# Altium schematic sheet MCU.SchDoc: MCU
size 431 x 279 mm; Author: Alberto Marrone, Christian Schmitz, Leo Walter; DrawnBy: Alberto Marrone, Christian Schmitz, Leo Walter; Engineer: Alberto Marrone, Christian Schmitz, Leo Walter; Revision: V1.0; SheetNumber: 5; Project: PCB Design Final Project
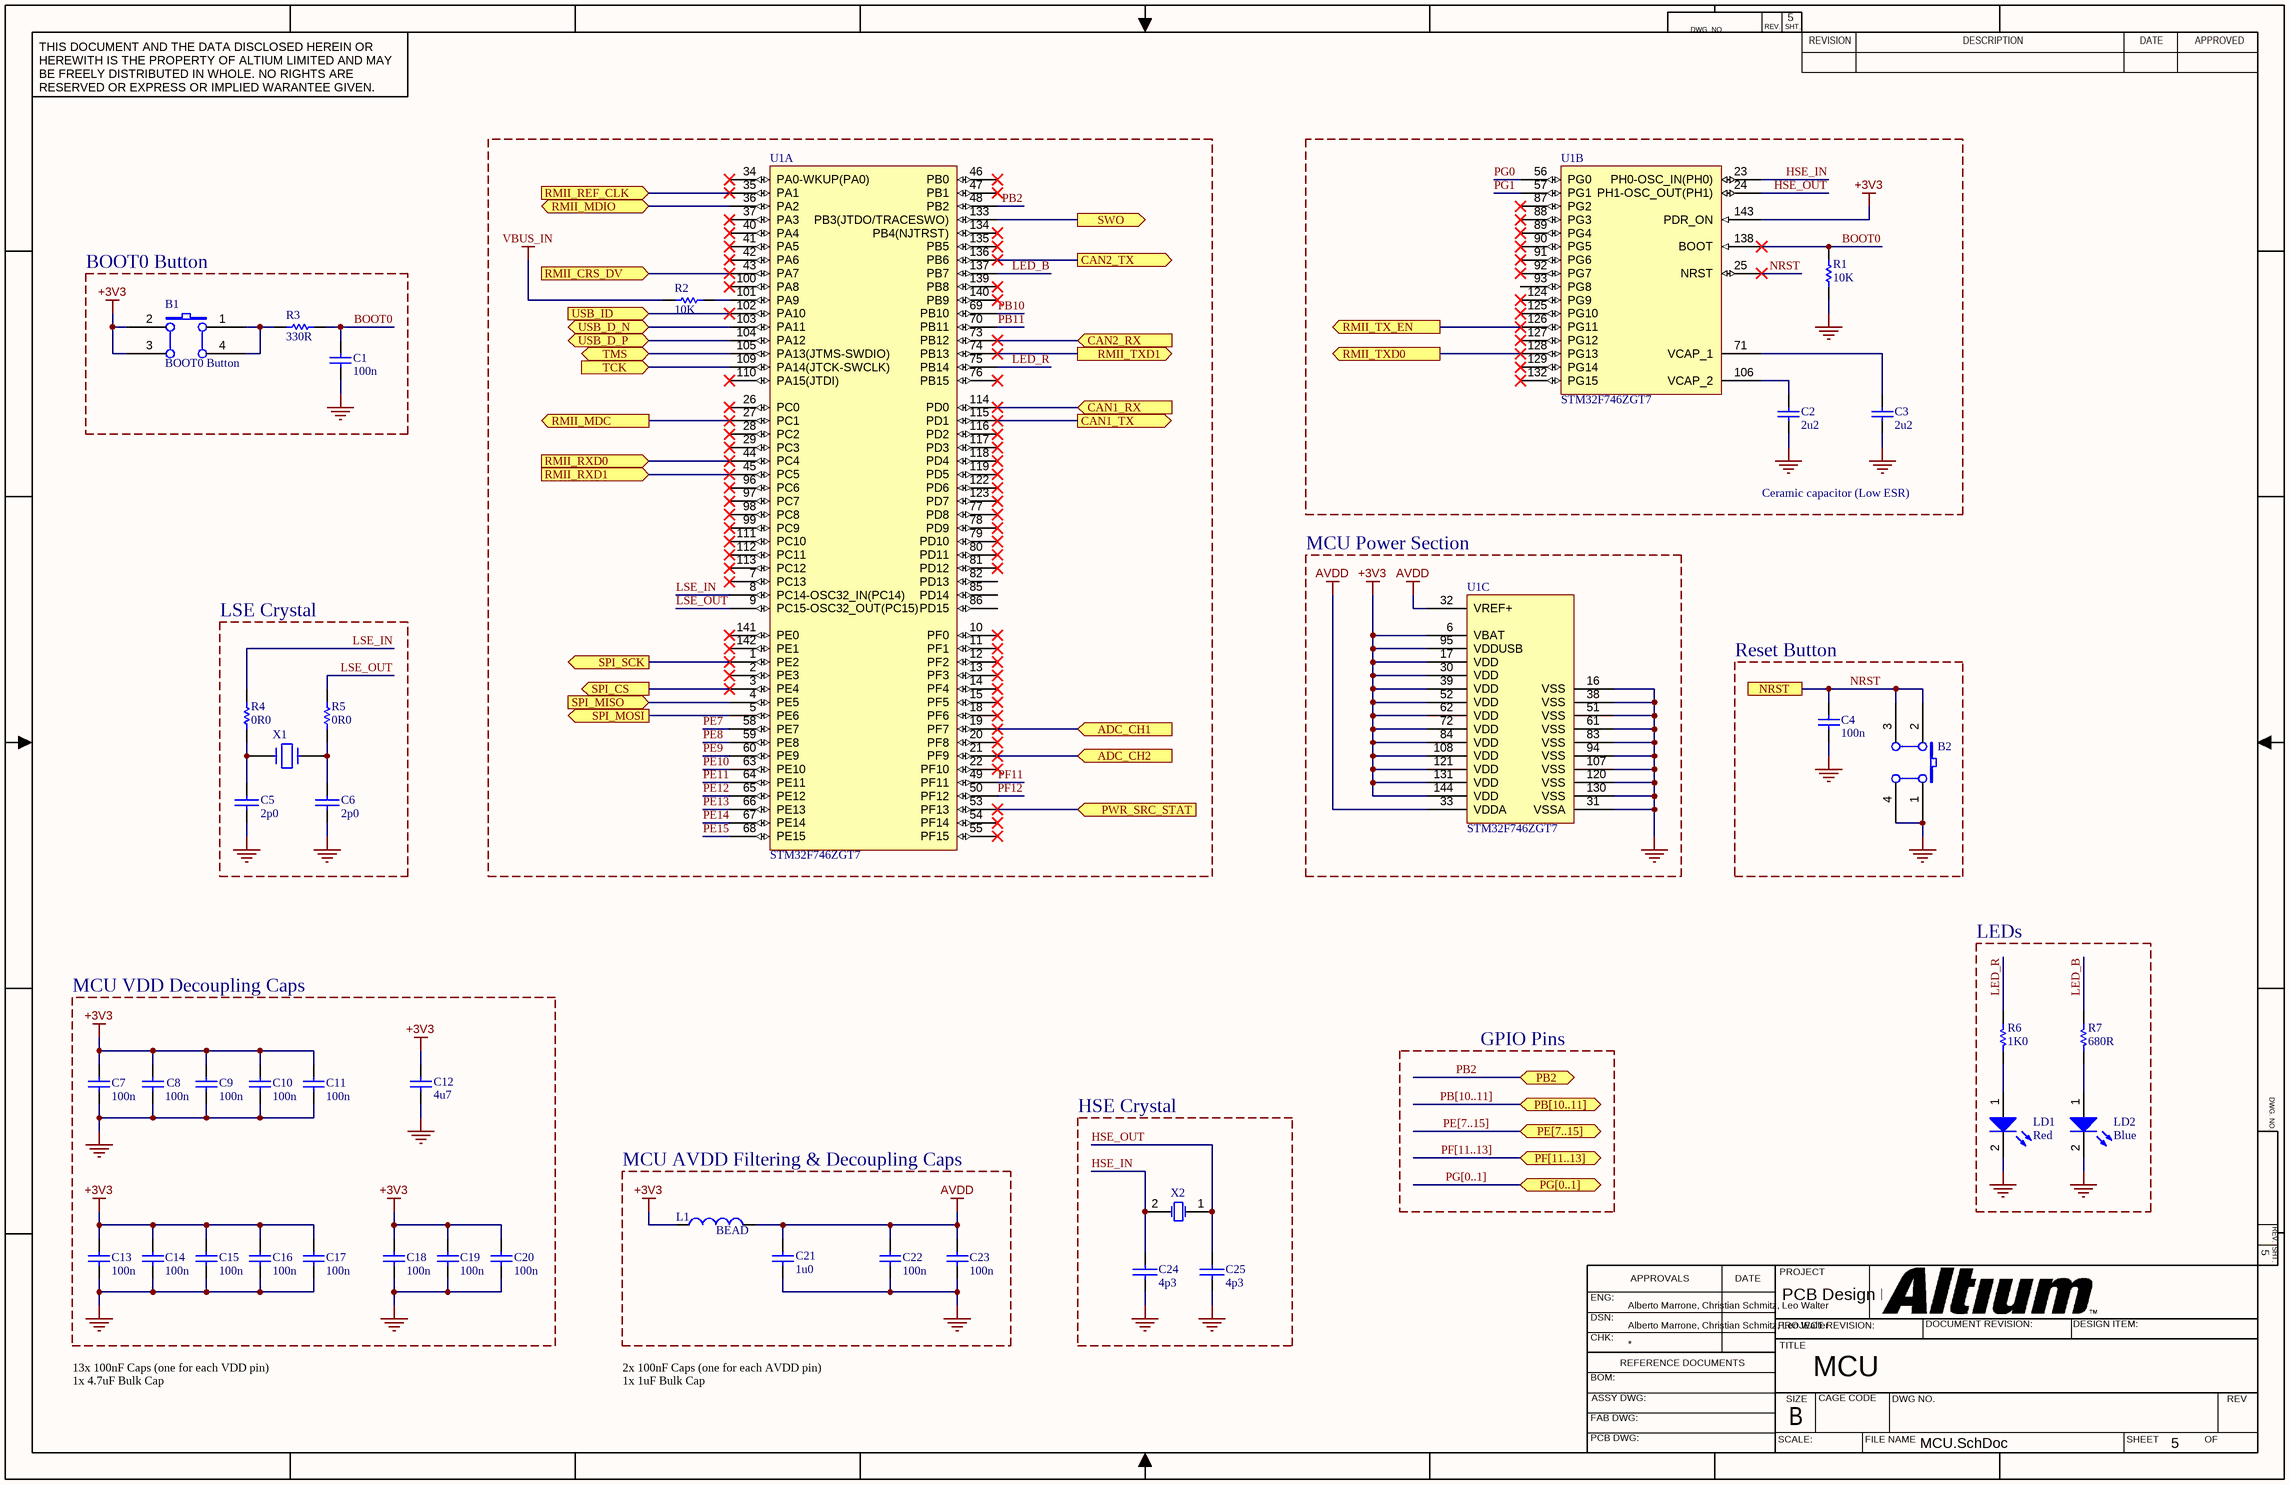
[diagram p0: MCU.SchDoc]

## Parts
B1  BOOT0 Button  [PB-6X6mm-Blue]
B2  TS40-66-33-BK-160-SMT-TR  [PB-6X6mm-Black]  (value not drawn)
C1  100n  [0603C]
C2  2u2  [TAN-A]
C3  2u2  [TAN-A]
C4  100n  [0603C]
C5  2p0  [0603C]
C6  2p0  [0603C]
C7  100n  [0603C]
C8  100n  [0603C]
C9  100n  [0603C]
C10  100n  [0603C]
C11  100n  [0603C]
C12  4u7  [0603C]
C13  100n  [0603C]
C14  100n  [0603C]
C15  100n  [0603C]
C16  100n  [0603C]
C17  100n  [0603C]
C18  100n  [0603C]
C19  100n  [0603C]
C20  100n  [0603C]
C21  1u0  [0603C]
C22  100n  [0603C]
C23  100n  [0603C]
C24  4p3  [0603C]
C25  4p3  [0603C]
L1  BEAD  [0603L]
LD1  Red  [0603D-R]
LD2  Blue  [0603D-B]
R1  10K  [0603R]
R2  10K  [0603R]
R3  330R  [0603R]
R4  0R0  [0603R]
R5  0R0  [0603R]
R6  1K0  [0603R]
R7  680R  [0603R]
U1  STM32F746ZGT7  [STM-LQFP144_M]  (parts A,B,C of 3)
X1  ABS07-120-32.768KHZ-T  [XTAL_2SM_3R2X1R5]  (value not drawn)
X2  ABM8AAIG-8.000MHz-V2R-T3  [OSC_2SM_3R2x2R5]  (value not drawn)

## Blocks framed on the sheet
Ceramic capacitor (Low ESR): C2 C3 R1 U1
BOOT0 Button: B1 C1 R3
MCU Power Section: U1
LSE Crystal: C5 C6 R4 R5 X1
Reset Button: B2 C4
LEDs: LD1 LD2 R6 R7
MCU VDD Decoupling Caps: C7-C20
HSE Crystal: C24 C25 X2
MCU AVDD Filtering & Decoupling Caps: C21-C23 L1

## Ports
ADC_CH1 (in), ADC_CH2 (in), CAN1_RX (in), CAN1_TX (out), CAN2_RX (in), CAN2_TX (out), NRST, PB2 (bidir), PB[10..11] (bidir), PE[7..15] (bidir), PF[11..13] (bidir), PG[0..1] (bidir), PWR_SRC_STAT (in), RMII_CRS_DV (in), RMII_MDC (out), RMII_MDIO (bidir), RMII_REF_CLK (in), RMII_RXD0 (in), RMII_RXD1 (in), RMII_TX_EN (out), RMII_TXD0 (out), RMII_TXD1 (out), SPI_CS (out), SPI_MISO (in), SPI_MOSI (out), SPI_SCK (out), SWO (out), TCK (in), TMS (bidir), USB_D_N (bidir), USB_D_P (bidir), USB_ID (in)

## Nets
+3V3: B1.2(B0) B1.3(B1) C7.1 C8.1 C9.1 C10.1 C11.1 C12.1 C13.1 C14.1 C15.1 C16.1 C17.1 C18.1 C19.1 C20.1 L1.1 U1.6(VBAT) U1.17(VDD) U1.30(VDD) U1.39(VDD) U1.52(VDD) U1.62(VDD) U1.72(VDD) U1.84(VDD) U1.95(VDDUSB) U1.108(VDD) U1.121(VDD) U1.131(VDD) U1.143(PDR_ON) U1.144(VDD)
AVDD: C21.1 C22.1 C23.1 L1.2 U1.32(VREF+) U1.33(VDDA)
GND: B2.1(A0) B2.4(A1) C1.1 C2.2 C3.2 C4.1 C5.2 C6.2 C7.2 C8.2 C9.2 C10.2 C11.2 C12.2 C13.2 C14.2 C15.2 C16.2 C17.2 C18.2 C19.2 C20.2 C21.2 C22.2 C23.2 C24.2 C25.2 LD1.2(K) LD2.2(K) R1.2 U1.16(VSS) U1.31(VSSA) U1.38(VSS) U1.51(VSS) U1.61(VSS) U1.83(VSS) U1.94(VSS) U1.107(VSS) U1.120(VSS) U1.130(VSS)
VBUS_IN: R2.1
ADC_CH1: U1.19(PF7) ; port ADC_CH1
ADC_CH2: U1.21(PF9) ; port ADC_CH2
BOOT0: C1.2 R1.1 R3.2 U1.138(BOOT)
CAN1_RX: U1.114(PD0) ; port CAN1_RX
CAN1_TX: U1.115(PD1) ; port CAN1_TX
CAN2_RX: U1.73(PB12) ; port CAN2_RX
CAN2_TX: U1.136(PB6) ; port CAN2_TX
HSE_IN: C24.1 U1.23(PH0-OSC_IN(PH0)) X2.2(OSC2)
HSE_OUT: C25.1 U1.24(PH1-OSC_OUT(PH1)) X2.1(OSC1)
LED_B: R7.1 U1.137(PB7)
LED_R: R6.1 U1.75(PB14)
LSE_IN: R4.2 U1.8(PC14-OSC32_IN(PC14))
LSE_OUT: R5.2 U1.9(PC15-OSC32_OUT(PC15))
NRST: B2.2(B0) B2.3(B1) C4.2 U1.25(NRST) ; port NRST
PB2: U1.48(PB2) ; port PB2
PB10: U1.69(PB10)
PB11: U1.70(PB11)
PE7: U1.58(PE7)
PE8: U1.59(PE8)
PE9: U1.60(PE9)
PE10: U1.63(PE10)
PE11: U1.64(PE11)
PE12: U1.65(PE12)
PE13: U1.66(PE13)
PE14: U1.67(PE14)
PE15: U1.68(PE15)
PF11: U1.49(PF11)
PF12: U1.50(PF12)
PG0: U1.56(PG0)
PG1: U1.57(PG1)
PWR_SRC_STAT: U1.53(PF13) ; port PWR_SRC_STAT
RMII_CRS_DV: U1.43(PA7) ; port RMII_CRS_DV
RMII_MDC: U1.27(PC1) ; port RMII_MDC
RMII_MDIO: U1.36(PA2) ; port RMII_MDIO
RMII_REF_CLK: U1.35(PA1) ; port RMII_REF_CLK
RMII_RXD0: U1.44(PC4) ; port RMII_RXD0
RMII_RXD1: U1.45(PC5) ; port RMII_RXD1
RMII_TX_EN: U1.126(PG11) ; port RMII_TX_EN
RMII_TXD0: U1.128(PG13) ; port RMII_TXD0
RMII_TXD1: U1.74(PB13) ; port RMII_TXD1
SPI_CS: U1.3(PE4) ; port SPI_CS
SPI_MISO: U1.4(PE5) ; port SPI_MISO
SPI_MOSI: U1.5(PE6) ; port SPI_MOSI
SPI_SCK: U1.1(PE2) ; port SPI_SCK
SWO: U1.133(PB3(JTDO/TRACESWO)) ; port SWO
TCK: U1.109(PA14(JTCK-SWCLK)) ; port TCK
TMS: U1.105(PA13(JTMS-SWDIO)) ; port TMS
USB_D_N: U1.103(PA11) ; port USB_D_N
USB_D_P: U1.104(PA12) ; port USB_D_P
USB_ID: U1.102(PA10) ; port USB_ID
NetB1_1: B1.1(A0) B1.4(A1) R3.1
NetC2_1: C2.1 U1.106(VCAP_2)
NetC3_1: C3.1 U1.71(VCAP_1)
NetC5_1: C5.1 R4.1 X1.2
NetC6_1: C6.1 R5.1 X1.1
NetLD1_1: LD1.1(A) R6.2
NetLD2_1: LD2.1(A) R7.2
NetR2_2: R2.2 U1.101(PA9)

Not connected (* = marked no-connect by the designer): U1 2(PE3)* 7(PC13)* 10(PF0)* 11(PF1)* 12(PF2)* 13(PF3)* 14(PF4)* 15(PF5)* 18(PF6)* 20(PF8)* 22(PF10)* 26(PC0)* 28(PC2)* 29(PC3)* 34(PA0-WKUP(PA0))* 37(PA3)* 40(PA4)* 41(PA5)* 42(PA6)* 46(PB0)* 47(PB1)* 54(PF14)* 55(PF15)* 76(PB15)* 77(PD8)* 78(PD9)* 79(PD10)* 80(PD11)* 81(PD12)* 82(PD13) 85(PD14) 86(PD15) 87(PG2)* 88(PG3)* 89(PG4)* 90(PG5)* 91(PG6)* 92(PG7)* 93(PG8) 96(PC6)* 97(PC7)* 98(PC8)* 99(PC9)* 100(PA8)* 110(PA15(JTDI))* 111(PC10)* 112(PC11)* 113(PC12)* 116(PD2)* 117(PD3)* 118(PD4)* 119(PD5)* 122(PD6)* 123(PD7)* 124(PG9)* 125(PG10)* 127(PG12)* 129(PG14)* 132(PG15)* 134(PB4(NJTRST))* 135(PB5)* 139(PB8)* 140(PB9)* 141(PE0)* 142(PE1)*

## Buses and harness runs
bus PB[10..11] = port PB[10..11]
bus PE[7..15] = port PE[7..15]
bus PF[11..13] = port PF[11..13]
bus PG[0..1] = port PG[0..1]

## Notes on the sheet
- GPIO Pins
- 13x 100nF Caps (one for each VDD pin)
  1x 4.7uF Bulk Cap
- 2x 100nF Caps (one for each AVDD pin)
  1x 1uF Bulk Cap
- DWG. NO.
- REV.
- SHT.
- THIS DOCUMENT AND THE DATA DISCLOSED HEREIN OR HEREWITH IS THE PROPERTY OF ALTIUM LIMITED AND MAY BE FREELY DISTRIBUTED IN WHOLE. NO RIGHTS ARE RESERVED OR EXPRESS OR IMPLIED WARANTEE GIVEN.
- REVISION
- DESCRIPTION
- DATE
- APPROVED
- ENG:
- APPROVALS
- PROJECT
- DSN:
- CHK:
- REFERENCE DOCUMENTS
- PROJECT REVISION:
- TITLE
- DOCUMENT REVISION:
- DESIGN ITEM:
- BOM:
- FAB DWG:
- PCB DWG:
- ASSY DWG:
- SCALE:
- SIZE
- B
- CAGE CODE
- FILE NAME
- DWG NO.
- SHEET
- OF
- REV

## Library data of the parts
B1 B2 = SW PUSHBUTTON: SE PUSHBUTTON
C1 C4 C7-C11 C13-C20 C22 C23 = Cap: Capacitor; Dielectric: X7R; Published: 8-Jun-2000; Revision: July-2002: Re-released for DXP Platform.; Publisher: Altium Limited; Value: 100n
C2 C3 = Cap_2.2uF_X7R_10%_0805: Capacitor,2.2uF,16V, X7R,10%,0805,YAGEO; Manuf_Part_1: CC0805KKX7R7BB225; Revision: July-2002: Re-released for DXP Platform.; Value: 2u2; Order: CC0805KKX7R7BB225; Manuf_1: YAGEO; Dielectric: X7R
C5 C6 C24 C25 = CAP: Capacitor; Dielectric: C0G
  C5 C6: Value: 2p0
  C24 C25: Value: 4p3
C12 = CAP SMD 0603  X5R 1µF 25V 10%: Capacitor; Rated voltage: 25V; Tolerance: 10%; Dielectric: X5R; Manufacturer: *; Manufacturer P/N: *; Order code Farnell: 1288202RL; Value: 4u7; Power: *; Temperature  Factor: *; Temperature Max: +125°C; Temperature Min: -55°C; STS Code: *
C21 = CAP SMD 0603  X5R 1µF 25V 10%: Capacitor; Voltage Rating: 25V; Tolerance: 10%; Dielectric: X5R; Manufacturer: *; Manufacturer P/N: *; Order code Farnell: 1288202RL; Value: 1u0; Power: *; Temperature  Factor: *; Temperature Max: +125°C; Temperature Min: -55°C; STS Code: *
L1 = Inductor: Value: 100uH; Published: 8-Jun-2000; Revision: July-2002: Re-released for DXP Platform.; Publisher: Altium Limited
LD1 LD2 = LED2: Typical RED, GREEN, YELLOW, AMBER GaAs LED; Published: 8-Jun-2000; Revision: July-2002: Re-released for DXP Platform.; Publisher: Altium Limited
R1 R2 = res1: Resistor; Published: 8-Jun-2000; Revision: July-2002: Re-released for DXP Platform.; Publisher: Altium Limited; Value: 10K
R3 R6 R7 = Res1: Resistor; Published: 8-Jun-2000; Revision: July-2002: Re-released for DXP Platform.; Publisher: Altium Limited
  R3: Value: 330R
  R6: Value: 1K0
  R7: Value: 680R
R4 R5 = Res1: Resistor; Value: 1K; Published: 8-Jun-2000; Revision: July-2002: Re-released for DXP Platform.; Publisher: Altium Limited
U1 = CMP-1572-00045-1: ARM Cortex-M4 32-bit MCU+FPU, 1024 KB Flash, 320 KB Internal RAM, 114 I/Os, 144-Pin LQFP, -40 to 105 degC, Tray; I/Os (High Current): 114; FLASH Size (Prog) (kB): 1024; Core: ARM Cortex-M7; Operating Frequency(F) (Processor speed) (MHz): 216; D/A Converter: 2; Internal RAM Size (kB): 320; Supply Voltage(Vcc) min (V): 1.7; DatasheetVersion: Rev. 2; ComponentLink1Description: Manufacturer URL; ComponentLink1URL: http://www.st.com/; ComponentLink2URL: http://www.st.com/st-web-ui/static/active/en/resource/technical/document/datasheet/DM00166116.pdf; Packing: Tray; Package Description: 144-Pin Low Profile Quad Flat Package, Body 20 x 20 mm, Pitch 0.5 mm; ComponentLink2Description: Datasheet; Mounting Technology: Surface Mount; Package Reference: LQFP144
X1 = CRYSTAL_32K: Crystal
X2 = XTAL: Crystal Oscillator; Published: 8-Jun-2000; LatestRevisionDate: 17-Jul-2002; LatestRevisionNote: Re-released for DXP Platform.; PackageReference: R38; Publisher: Altium Limited